# EAGLE design SMD_LED_Breakout (EAGLE 8.2.2)
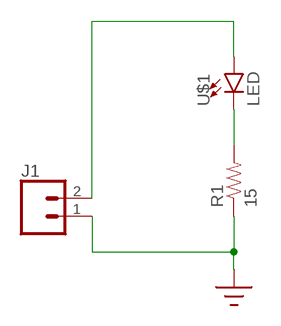
[diagram p0: schematic, sheet 1]

## Parts
J1  CONN_02  [1X02]
R1  15  RESISTORPTH-1W  [AXIAL-0.6]
U$1  LED  [VSMY7852X01-GS08]

## Nets
GND: J1.1 R1.P$1
GND_PATH: R1.P$2 U$1.-(C)
VIN: J1.2 U$1.+(A)

## Library data of the parts
J1 = SparkFun-Connectors:CONN_02: Multi connection point. Often used as Generic Header-pin footprint for 0.1 inch spaced/style header connections On any of the 0.1 inch spaced packages, you can populate with these: Break Away Headers - Straight <https://www.sparkfun.com/products/116> (PRT-00116) Break Away Male Headers - Right Angle <https://www.sparkfun.com/products/553> (PRT-00553) Female Headers <https://www.sparkfun.com/products/115> (PRT-00115) Break Away Headers - Machine Pin <https://www.sparkfun.com/products/117> (PRT-00117) Break Away Female Headers - Swiss Machine Pin <https://www.sparkfun.com/products/743> (PRT-00743) For SCREWTERMINALS and SPRING TERMINALS visit here: Screw Terimnals on SparkFun.com <https://www.sparkfun.com/search/results?term=Screw+Terminals> (5mm/3.5mm/2.54mm spacing) This device is also useful as a general connection point to wire up your design to another part of your project. Our various solder wires solder well into these plated through hole pads. Hook-Up Wire - Assortment (Stranded, 22 AWG) <https://www.sparkfun.com/products/11375> (PRT-11375) Hook-Up Wire - Assortment (Solid Core, 22 AWG) <https://www.sparkfun.com/products/11367> (PRT-11367) View the entire wire category on our website here <https://www.sparkfun.com/categories/141> Special notes: Molex polarized connector foot print use with: PRT-08233 with associated crimp pins and housings. 2.54_SCREWTERM for use with PRT-10571. 3.5mm Screw Terminal footprints for PRT-08084 5mm Screw Terminal footprints for use with PRT-08432
R1 = SparkFun-Passives:RESISTOR: Resistor Basic schematic elements and footprints for 0603, 1206, and PTH resistors.
U$1 = TinkerTech:LED

## Board
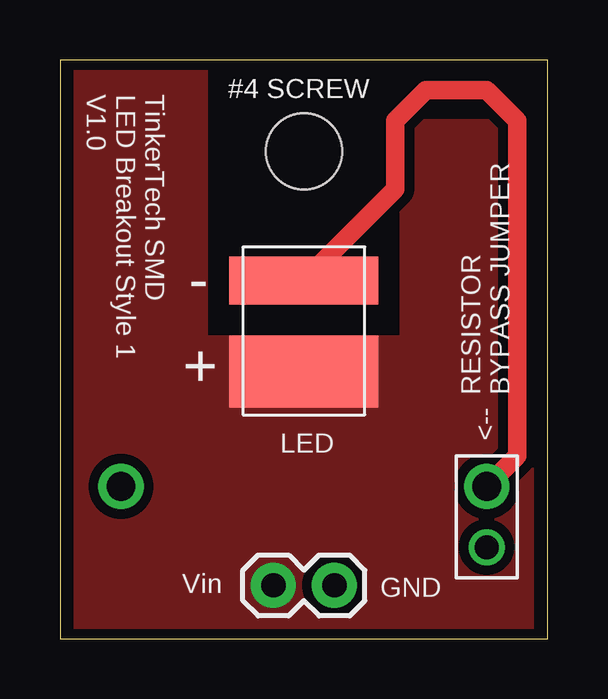
[diagram p1: board, top side]
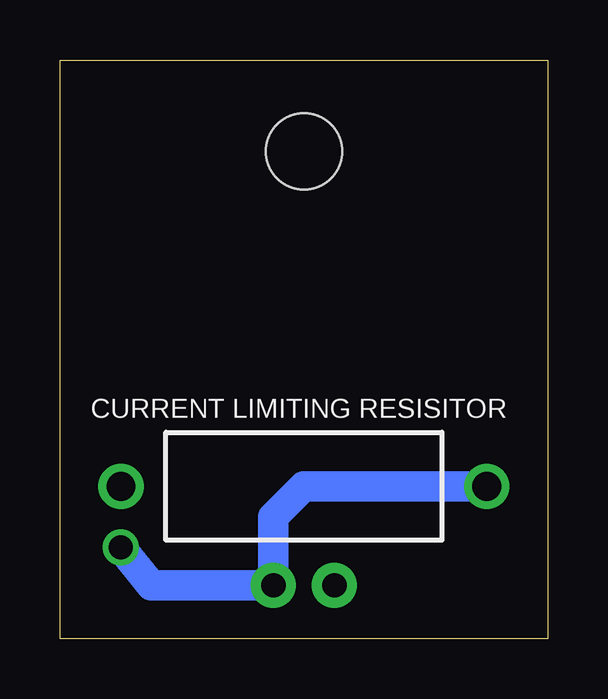
[diagram p2: board, bottom side, seen from below]

Size 20.32 x 24.13 mm. Coordinates in mm from the lower left corner, seen from the top.
Outline: 0,0 20.32,0 20.32,24.13 0,24.13 0,0
Copper layers (1*16): Top 0.0356mm / dielectric 1.5011mm / Bottom 0.0356mm
Design rules "oshpark-2layer": minimum track width 6mil, minimum drill 13mil, track to track 6mil, track to pad 6mil, pad to pad 6mil, via to via 6mil, smd to smd 6mil, copper to edge 15mil, drill to drill 6mil, minimum pad ring 7mil, minimum via ring 7mil, stop-mask expansion 2.5mil, vias tented up to drill 0mil, thermal gap 10mil
Holes 3.17 mm at 10.16,20.32
tKeepout: area 7.2,17.4 to 13.1,23.2

### Footprints (pad centres in the part's own frame; a part is rotated, then mirrored left to right if it is on the bottom)
1X02 = drill 1.016 pad 1.88: 1 0,0; 2 2.54,0
AXIAL-0.6 = drill 1.2 pad 1.88: P$1 -7.62,0; P$2 7.62,0
VSMY7852X01-GS08 = smd 6.2 x 3: + 0,-2.2 | smd 6.2 x 2: - 0,1.6

### Placement (x,y rotation side)
J1  11.43,2.22 180 top
R1  10.16,6.35 180 bottom
U$1  10.16,13.34 0 top

### Tracks (layer width: path | path; a pad name or v marks a point on that pad's centre or on a via)
GND  (via drill 1)
  Bottom 1.27: v17.78,3.81 16.51,2.22 J1.1 11.43,5.08 10.16,6.35 R1.P$1
GND_PATH
  Top 0.762: R1.P$2 19.05,7.62 19.05,21.59 17.78,22.86 15.24,22.86 13.97,21.59 13.97,18.75 U$1.-
VIN
  pour Top (isolate 0.406, no thermals): 0.64,24.13 0.64,0 19.68,0 19.68,21.59 14.22,21.59 14.22,12.57 6.1,12.57 6.1,24.13

### Text on the board
tPlace: TinkerTech SMD / LED Breakout Style 1 / V1.0 | #4 SCREW
tNames: - | + | RESISTOR / BYPASS JUMPER | LED | <-- | Vin | GND
bNames: CURRENT LIMITING RESISITOR